# Altium schematic sheet STM32F103ZET6.SCHDOC
size A2
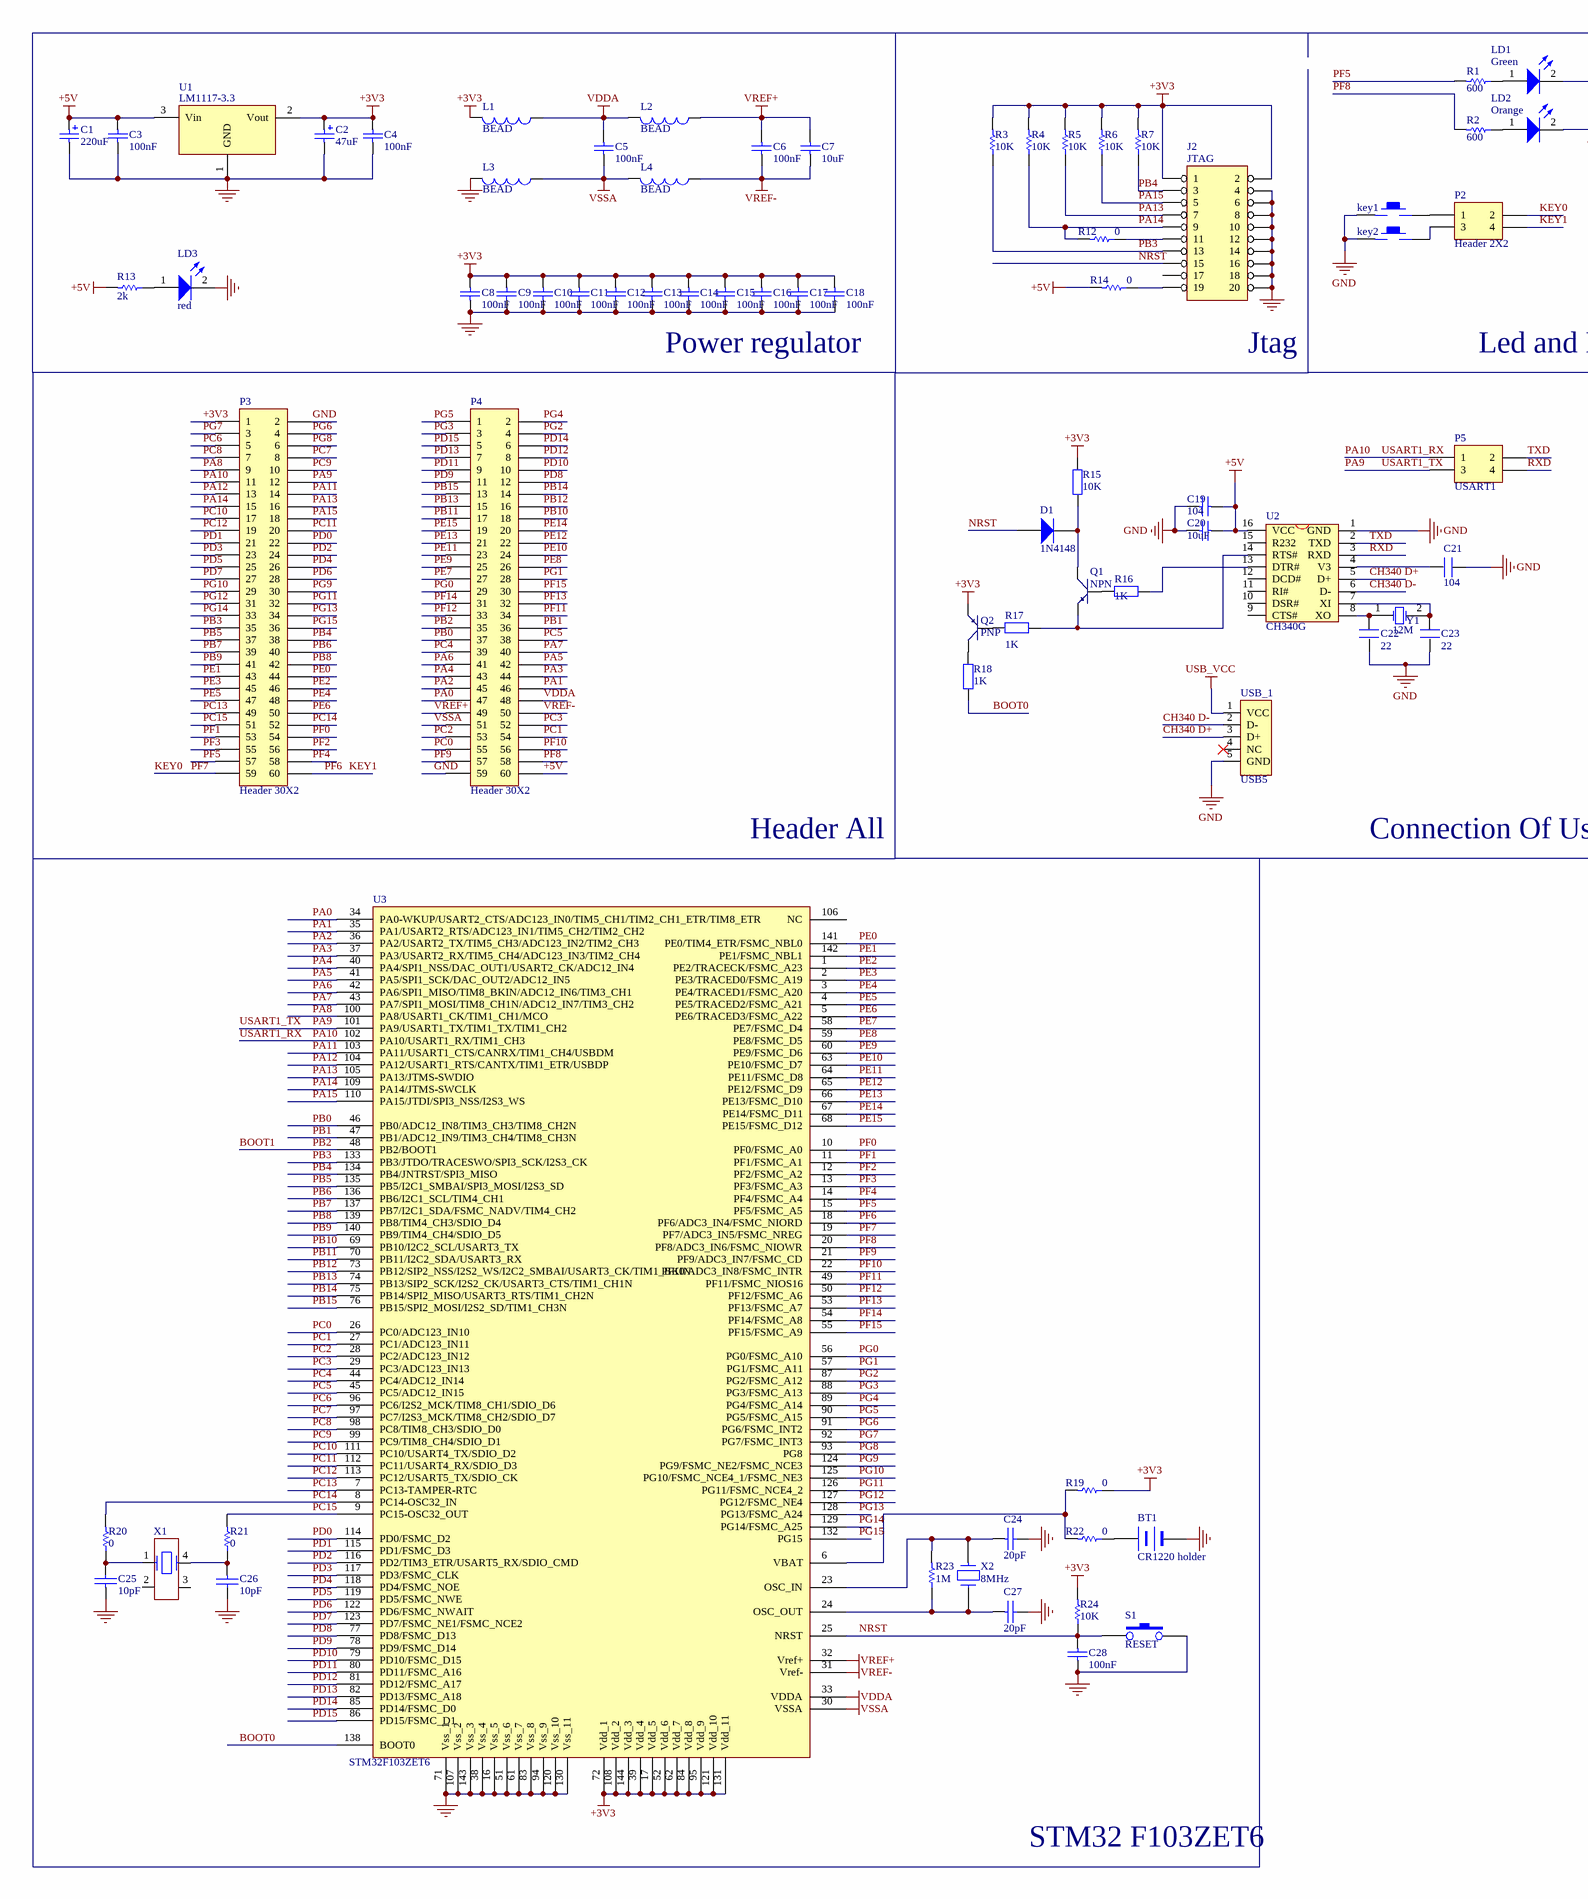
[diagram p0: STM32F103ZET6.SCHDOC, left]
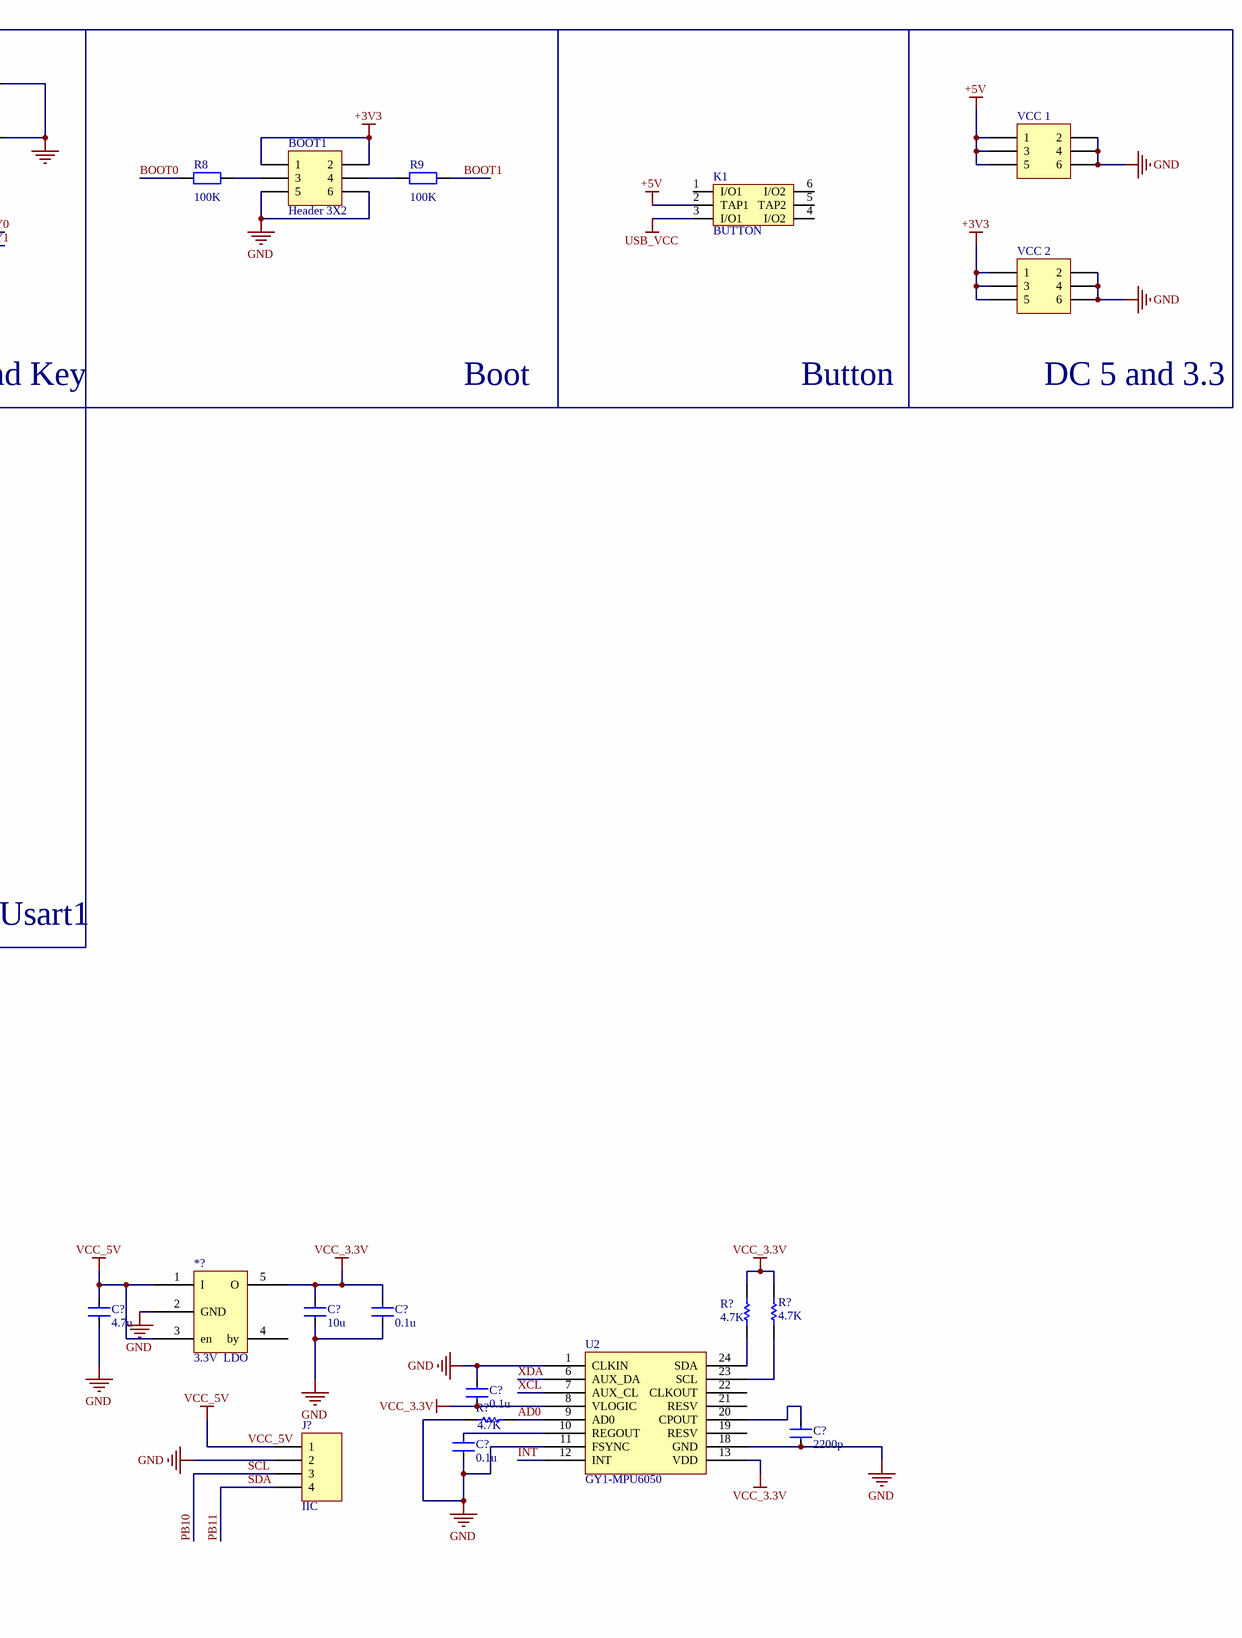
[diagram p1: STM32F103ZET6.SCHDOC, right]

## Parts
(Parts that share a designator on the sheet are numbered #1, #2 ... from top to bottom, then left to right.)
*?  3.3V  LDO  [SOT235]
BOOT1  Header 3X2  [HDR2X3]
BT1  CR1220 holder  [BAT]
C1  220uF  [3528]
C2  47uF  [3528]
C3  100nF  [0603P]
C4  100nF  [0603P]
C5  100nF  [0603P]
C6  100nF  [0603P]
C7  10uF  [3528]
C8  100nF  [0603P]
C9  100nF  [0603P]
C10  100nF  [0603P]
C11  100nF  [0603P]
C12  100nF  [0603P]
C13  100nF  [0603P]
C14  100nF  [0603P]
C15  100nF  [0603P]
C16  100nF  [0603P]
C17  100nF  [0603P]
C18  100nF  [0603P]
C19  value 104  [0603P]  (hidden comment: Cap)
C20  value 10uF  [0603P]  (hidden comment: Cap)
C21  104  [0603P]
C22  22  [0603P]
C23  22  [0603P]
C24  20pF  [0603P]
C25  10pF  [0603P]
C26  10pF  [0603P]
C27  20pF  [0603P]
C28  100nF  [0603P]
C?#1  4.7u  [1608[0603]]
C?#2  10u  [3.2X1.6X1.1]
C?#3  0.1u  [1608[0603]]
C?#4  0.1u  [1608[0603]]
C?#5  2200p  [1608[0603]]
C?#6  0.1u  [1608[0603]]
D1  1N4148  [DO-35]
J2  JTAG  [JTAG_20PIN]
J?  IIC  [SH-3]
K1  BUTTON  [BTN8.5*8.5]
key1  KEY_M  [KEY_M]  (value not drawn)
key2  KEY_M  [KEY_M]  (value not drawn)
L1  BEAD  [0603P]
L2  BEAD  [0603P]
L3  BEAD  [0603P]
L4  BEAD  [0603P]
LD1  Green  [0603P]
LD2  Orange  [0603P]
LD3  red  [0603P]
P2  Header 2X2  [HDR2X2]
P3  Header 30X2  [60pin]
P4  Header 30X2  [60pin]
P5  USART1  [HDR2X2]
Q1  NPN  [SOT-23R]
Q2  PNP  [SOT-23R]
R1  600  [0603P]
R2  600  [0603P]
R3  10K  [0603P]
R4  10K  [0603P]
R5  10K  [0603P]
R6  10K  [0603P]
R7  10K  [0603P]
R8  value 100K  [0603P]  (hidden comment: Res2)
R9  value 100K  [0603P]  (hidden comment: Res2)
R12  0  [0603P]
R13  2k  [0603P]
R14  0  [0603P]
R15  value 10K  [0603P]  (hidden comment: Res2)
R16  value 1K  [0603P]  (hidden comment: Res2)
R17  value 1K  [0603P]  (hidden comment: Res2)
R18  value 1K  [0603P]  (hidden comment: Res2)
R19  0  [0603P]
R20  0  [0603P]
R21  0  [0603P]
R22  0  [0603P]
R23  1M  [0603P]
R24  10K  [0603P]
R?#1  4.7K  [1608[0603]]
R?#2  4.7K  [1608[0603]]
R?#3  4.7K  [1608[0603]]
S1  RESET  [KEY_M]
U1  LM1117-3.3  [1117]
U2#1  CH340G  [SOP16M]
U2#2  GY1-MPU6050  [MPU6050]
U3  STM32F103ZET6  [TQFP144-B]
USB_1  USB5  [USB/SM0.8-6H5]
VCC_1  Header 3X2  [HDR2X3]  (value not drawn)
VCC_2  Header 3X2  [HDR2X3]  (value not drawn)
X1  MC306-G-06Q-32.768 (manufacturer JFVNY)  [SM8]  (value not drawn)
X2  8MHz  [XTAL_16S]
Y1  12M  [XTAL_US]

## Nets
+3V3: BOOT1.1 BOOT1.2 C2.1 C4.1 C8.1 C9.1 C10.1 C11.1 C12.1 C13.1 C14.1 C15.1 C16.1 C17.1 C18.1 J2.1 J2.2 L1.2 P3.1 Q2.1(E) R3.2 R4.2 R5.2 R6.2 R7.2 R15.2 R19.1 R24.2 U1.2(Vout) U3.17(Vdd_5) U3.39(Vdd_4) U3.52(Vdd_6) U3.62(Vdd_7) U3.72(Vdd_1) U3.84(Vdd_8) U3.95(Vdd_9) U3.108(Vdd_2) U3.121(Vdd_10) U3.131(Vdd_11) U3.144(Vdd_3) VCC_2.1 VCC_2.3 VCC_2.5
+5V: C1.1 C3.1 C19.2 C20.2 K1.2(TAP1) P4.60 R13.2 R14.2 U1.3(Vin) U2#1.16(VCC) VCC_1.1 VCC_1.3 VCC_1.5
GND: *?.2(GND) BOOT1.5 BOOT1.6 BT1.2(-) C1.2 C2.2 C3.2 C4.2 C8.2 C9.2 C10.2 C11.2 C12.2 C13.2 C14.2 C15.2 C16.2 C17.2 C18.2 C19.1 C20.1 C21.1 C22.1 C23.1 C24.2 C25.1 C26.2 C27.2 C28.1 C?#1.2 C?#2.2 C?#3.2 C?#4.1 C?#5.2 C?#6.2 J2.4 J2.6 J2.8 J2.10 J2.12 J2.14 J2.16 J2.18 J2.20 J?.2 key1.1 key2.1 L3.2 LD1.2(K) LD2.2(K) LD3.2(K) P3.2 P4.59 R?#3.1 S1.2 U1.1(GND) U2#1.1(GND) U2#2.1(CLKIN) U2#2.11(FSYNC) U2#2.18(GND) U3.16(Vss_5) U3.38(Vss_4) U3.51(Vss_6) U3.61(Vss_7) U3.71(Vss_1) U3.83(Vss_8) U3.94(Vss_9) U3.107(Vss_2) U3.120(Vss_10) U3.130(Vss_11) U3.143(Vss_3) USB_1.5(GND) VCC_1.2 VCC_1.4 VCC_1.6 VCC_2.2 VCC_2.4 VCC_2.6
USB_VCC: K1.3(I/O1) USB_1.1(VCC)
VCC_3.3V: *?.5(O) C?#2.1 C?#3.1 C?#4.2 R?#1.2 R?#2.2 U2#2.8(VLOGIC) U2#2.13(VDD)
VCC_5V: *?.1(I) *?.3(en) C?#1.1 J?.1
VDDA: C5.1 L1.1 L2.2 P4.48 U3.33(VDDA)
VREF+: C6.1 C7.1 L2.1 P4.49 U3.32(Vref+)
VREF-: C6.2 C7.2 L4.1 P4.50 U3.31(Vref-)
VSSA: C5.2 L3.1 L4.2 P4.51 U3.30(VSSA)
AD0: R?#3.2 U2#2.9(AD0)
BOOT0: R8.1 R18.1 U3.138(BOOT0)
BOOT1: P4.35 R9.2 U3.48(PB2/BOOT1)  [also labelled PB2]
CH340 D+: U2#1.5(D+) USB_1.3(D+)
CH340 D-: U2#1.6(D-) USB_1.2(D-)
INT: U2#2.12(INT)
KEY0: P2.2 P3.59 U3.19(PF7/ADC3_IN5/FSMC_NREG)  [also labelled PF7]
KEY1: P2.4 P3.60 U3.18(PF6/ADC3_IN4/FSMC_NIORD)  [also labelled PF6]
NRST: C28.2 D1.1(A) J2.15 R24.1 S1.1 U3.25(NRST)
PA0: P4.47 U3.34(PA0-WKUP/USART2_CTS/ADC123_IN0/TIM5_CH1/TIM2_CH1_ETR/TIM8_ETR)
PA1: P4.46 U3.35(PA1/USART2_RTS/ADC123_IN1/TIM5_CH2/TIM2_CH2)
PA2: P4.45 U3.36(PA2/USART2_TX/TIM5_CH3/ADC123_IN2/TIM2_CH3)
PA3: P4.44 U3.37(PA3/USART2_RX/TIM5_CH4/ADC123_IN3/TIM2_CH4)
PA4: P4.43 U3.40(PA4/SPI1_NSS/DAC_OUT1/USART2_CK/ADC12_IN4)
PA5: P4.42 U3.41(PA5/SPI1_SCK/DAC_OUT2/ADC12_IN5)
PA6: P4.41 U3.42(PA6/SPI1_MISO/TIM8_BKIN/ADC12_IN6/TIM3_CH1)
PA7: P4.40 U3.43(PA7/SPI1_MOSI/TIM8_CH1N/ADC12_IN7/TIM3_CH2)
PA8: P3.9 U3.100(PA8/USART1_CK/TIM1_CH1/MCO)
PA9: P3.12 P5.3 U3.101(PA9/USART1_TX/TIM1_TX/TIM1_CH2)  [also labelled USART1_TX]
PA10: P3.11 P5.1 U3.102(PA10/USART1_RX/TIM1_CH3)  [also labelled USART1_RX]
PA11: P3.14 U3.103(PA11/USART1_CTS/CANRX/TIM1_CH4/USBDM)
PA12: P3.13 U3.104(PA12/USART1_RTS/CANTX/TIM1_ETR/USBDP)
PA13: J2.7 P3.16 R5.1 U3.105(PA13/JTMS-SWDIO)
PA14: J2.9 P3.15 R4.1 R12.2 U3.109(PA14/JTMS-SWCLK)
PA15: J2.5 P3.18 R6.1 U3.110(PA15/JTDI/SPI3_NSS/I2S3_WS)
PB0: P4.37 U3.46(PB0/ADC12_IN8/TIM3_CH3/TIM8_CH2N)
PB1: P4.36 U3.47(PB1/ADC12_IN9/TIM3_CH4/TIM8_CH3N)
PB3: J2.13 P3.35 R3.1 U3.133(PB3/JTDO/TRACESWO/SPI3_SCK/I2S3_CK)
PB4: J2.3 P3.38 R7.1 U3.134(PB4/JNTRST/SPI3_MISO)
PB5: P3.37 U3.135(PB5/I2C1_SMBAI/SPI3_MOSI/I2S3_SD)
PB6: P3.40 U3.136(PB6/I2C1_SCL/TIM4_CH1)
PB7: P3.39 U3.137(PB7/I2C1_SDA/FSMC_NADV/TIM4_CH2)
PB8: P3.42 U3.139(PB8/TIM4_CH3/SDIO_D4)
PB9: P3.41 U3.140(PB9/TIM4_CH4/SDIO_D5)
PB10: J?.3 P4.18 U3.69(PB10/I2C2_SCL/USART3_TX)  [also labelled SCL]
PB11: J?.4 P4.17 U3.70(PB11/I2C2_SDA/USART3_RX)  [also labelled SDA]
PB12: P4.16 U3.73(PB12/SIP2_NSS/I2S2_WS/I2C2_SMBAI/USART3_CK/TIM1_BKIN)
PB13: P4.15 U3.74(PB13/SIP2_SCK/I2S2_CK/USART3_CTS/TIM1_CH1N)
PB14: P4.14 U3.75(PB14/SPI2_MISO/USART3_RTS/TIM1_CH2N)
PB15: P4.13 U3.76(PB15/SPI2_MOSI/I2S2_SD/TIM1_CH3N)
PC0: P4.55 U3.26(PC0/ADC123_IN10)
PC1: P4.54 U3.27(PC1/ADC123_IN11)
PC2: P4.53 U3.28(PC2/ADC123_IN12)
PC3: P4.52 U3.29(PC3/ADC123_IN13)
PC4: P4.39 U3.44(PC4/ADC12_IN14)
PC5: P4.38 U3.45(PC5/ADC12_IN15)
PC6: P3.5 U3.96(PC6/I2S2_MCK/TIM8_CH1/SDIO_D6)
PC7: P3.8 U3.97(PC7/I2S3_MCK/TIM8_CH2/SDIO_D7)
PC8: P3.7 U3.98(PC8/TIM8_CH3/SDIO_D0)
PC9: P3.10 U3.99(PC9/TIM8_CH4/SDIO_D1)
PC10: P3.17 U3.111(PC10/USART4_TX/SDIO_D2)
PC11: P3.20 U3.112(PC11/USART4_RX/SDIO_D3)
PC12: P3.19 U3.113(PC12/USART5_TX/SDIO_CK)
PC13: P3.49 U3.7(PC13-TAMPER-RTC)
PC14: P3.52 R20.2 U3.8(PC14-OSC32_IN)
PC15: P3.51 R21.2 U3.9(PC15-OSC32_OUT)
PD0: P3.22 U3.114(PD0/FSMC_D2)
PD1: P3.21 U3.115(PD1/FSMC_D3)
PD2: P3.24 U3.116(PD2/TIM3_ETR/USART5_RX/SDIO_CMD)
PD3: P3.23 U3.117(PD3/FSMC_CLK)
PD4: P3.26 U3.118(PD4/FSMC_NOE)
PD5: P3.25 U3.119(PD5/FSMC_NWE)
PD6: P3.28 U3.122(PD6/FSMC_NWAIT)
PD7: P3.27 U3.123(PD7/FSMC_NE1/FSMC_NCE2)
PD8: P4.12 U3.77(PD8/FSMC_D13)
PD9: P4.11 U3.78(PD9/FSMC_D14)
PD10: P4.10 U3.79(PD10/FSMC_D15)
PD11: P4.9 U3.80(PD11/FSMC_A16)
PD12: P4.8 U3.81(PD12/FSMC_A17)
PD13: P4.7 U3.82(PD13/FSMC_A18)
PD14: P4.6 U3.85(PD14/FSMC_D0)
PD15: P4.5 U3.86(PD15/FSMC_D1)
PE0: P3.44 U3.141(PE0/TIM4_ETR/FSMC_NBL0)
PE1: P3.43 U3.142(PE1/FSMC_NBL1)
PE2: P3.46 U3.1(PE2/TRACECK/FSMC_A23)
PE3: P3.45 U3.2(PE3/TRACED0/FSMC_A19)
PE4: P3.48 U3.3(PE4/TRACED1/FSMC_A20)
PE5: P3.47 U3.4(PE5/TRACED2/FSMC_A21)
PE6: P3.50 U3.5(PE6/TRACED3/FSMC_A22)
PE7: P4.27 U3.58(PE7/FSMC_D4)
PE8: P4.26 U3.59(PE8/FSMC_D5)
PE9: P4.25 U3.60(PE9/FSMC_D6)
PE10: P4.24 U3.63(PE10/FSMC_D7)
PE11: P4.23 U3.64(PE11/FSMC_D8)
PE12: P4.22 U3.65(PE12/FSMC_D9)
PE13: P4.21 U3.66(PE13/FSMC_D10)
PE14: P4.20 U3.67(PE14/FSMC_D11)
PE15: P4.19 U3.68(PE15/FSMC_D12)
PF0: P3.54 U3.10(PF0/FSMC_A0)
PF1: P3.53 U3.11(PF1/FSMC_A1)
PF2: P3.56 U3.12(PF2/FSMC_A2)
PF3: P3.55 U3.13(PF3/FSMC_A3)
PF4: P3.58 U3.14(PF4/FSMC_A4)
PF5: P3.57 R1.2 U3.15(PF5/FSMC_A5)
PF8: P4.58 R2.2 U3.20(PF8/ADC3_IN6/FSMC_NIOWR)
PF9: P4.57 U3.21(PF9/ADC3_IN7/FSMC_CD)
PF10: P4.56 U3.22(PF10/ADC3_IN8/FSMC_INTR)
PF11: P4.34 U3.49(PF11/FSMC_NIOS16)
PF12: P4.33 U3.50(PF12/FSMC_A6)
PF13: P4.32 U3.53(PF13/FSMC_A7)
PF14: P4.31 U3.54(PF14/FSMC_A8)
PF15: P4.30 U3.55(PF15/FSMC_A9)
PG0: P4.29 U3.56(PG0/FSMC_A10)
PG1: P4.28 U3.57(PG1/FSMC_A11)
PG2: P4.4 U3.87(PG2/FSMC_A12)
PG3: P4.3 U3.88(PG3/FSMC_A13)
PG4: P4.2 U3.89(PG4/FSMC_A14)
PG5: P4.1 U3.90(PG5/FSMC_A15)
PG6: P3.4 U3.91(PG6/FSMC_INT2)
PG7: P3.3 U3.92(PG7/FSMC_INT3)
PG8: P3.6 U3.93(PG8)
PG9: P3.30 U3.124(PG9/FSMC_NE2/FSMC_NCE3)
PG10: P3.29 U3.125(PG10/FSMC_NCE4_1/FSMC_NE3)
PG11: P3.32 U3.126(PG11/FSMC_NCE4_2)
PG12: P3.31 U3.127(PG12/FSMC_NE4)
PG13: P3.34 U3.128(PG13/FSMC_A24)
PG14: P3.33 U3.129(PG14/FSMC_A25)
PG15: P3.36 U3.132(PG15)
RXD: P5.4 U2#1.3(RXD)
TXD: P5.2 U2#1.2(TXD)
XCL: U2#2.7(AUX_CL)
XDA: U2#2.6(AUX_DA)
NetBOOT1_3: BOOT1.3 R8.2
NetBOOT1_4: BOOT1.4 R9.1
NetBT1_1: BT1.1(+) R22.1
NetC21_2: C21.2 U2#1.4(V3)
NetC22_2: C22.2 U2#1.8(XO) Y1.1(OSC1)
NetC23_2: C23.2 U2#1.7(XI) Y1.2(OSC2)
NetC24_1: C24.1 R23.2 U3.23(OSC_IN) X2.1
NetC25_2: C25.2 R20.1 X1.1
NetC26_1: C26.1 R21.1 X1.4
NetC27_1: C27.1 R23.1 U3.24(OSC_OUT) X2.2
NetC?#5_1: C?#5.1 U2#2.20(CPOUT)
NetC?#6_1: C?#6.1 U2#2.10(REGOUT)
NetD1_2: D1.2(K) Q1.3(C) R15.1
NetJ2_11: J2.11 R12.1
NetJ2_19: J2.19 R14.1
Netkey1_2: key1.2 P2.1
Netkey2_2: key2.2 P2.3
NetLD1_1: LD1.1(A) R1.1
NetLD2_1: LD2.1(A) R2.1
NetLD3_1: LD3.1(A) R13.1
NetQ1_1: Q1.1(E) R17.2 U2#1.14(RTS#)
NetQ1_2: Q1.2(B) R16.1
NetQ2_2: Q2.2(B) R17.1
NetQ2_3: Q2.3(C) R18.2
NetR16_2: R16.2 U2#1.13(DTR#)
NetR19_2: R19.2 R22.2 U3.6(VBAT)
NetR?#1_1: R?#1.1 U2#2.24(SDA)
NetR?#2_1: R?#2.1 U2#2.23(SCL)

Not connected (* = marked no-connect by the designer): *? 4(by); J2 17; K1 1(I/O1) 4(I/O2) 5(TAP2) 6(I/O2); U2#1 9(CTS#) 10(DSR#) 11(RI#) 12(DCD#) 15(R232); U2#2 19(RESV) 21(RESV) 22(CLKOUT); U3 106(NC); USB_1 4(NC)*; X1 2 3

## Notes on the sheet
- Power regulator
- (near J2) Jtag
- Led and Key
- Boot
- Button
- DC 5 and 3.3
- Header All
- Connection Of Usart1
- STM32 F103ZET6

## Library data of the parts
BOOT1 VCC_1 VCC_2 = Header 3X2: Header, 3-Pin, Dual row; LatestRevisionDate: *; LatestRevisionNote: *; Publisher: *
BT1 = BATTERY
C1 C2 = Cap Pol1: Polarized Capacitor (Radial); Value: 10uF; Published: 8-Jun-2000; Revision: July-2002: Re-released for DXP Platform.; Publisher: Altium Limited
C3-C7 = Cap: Capacitor; Value: 10nF; Published: 8-Jun-2000; Revision: July-2002: Re-released for DXP Platform.; Publisher: Altium Limited
C8-C18 C24-C27 = CAP: Capacitor
  C8-C18: Published: 8-Jun-2000; Revision: July-2002: Re-released for DXP Platform.; Publisher: Altium Limited; Value: 100nF
C19 C20 = Cap: Capacitor; Published: 8-Jun-2000; LatestRevisionDate: 17-Jul-2002; LatestRevisionNote: Re-released for DXP Platform.; PackageReference: RAD-0.3; Publisher: Altium Limited
C21-C23 = C
C28 = CAP: Capacitor; Value: 100pF; Published: 8-Jun-2000; Revision: July-2002: Re-released for DXP Platform.; Publisher: Altium Limited
C?#1-C?#6 = CAP-0.1UF: SMD-CAP
D1 = Diode 1N4148: High Conductance Fast Diode; Published: 8-Jun-2000; LatestRevisionDate: 17-Jul-2002; LatestRevisionNote: Re-released for DXP Platform.; DatasheetDocument: 1997; PackageReference: DO-35; Publisher: Altium Limited; Code_JEDEC: DO-204-AH; ComponentLink1Description: Manufacturer Link; ComponentLink1URL: http://www.fairchildsemi.com/; ComponentLink2Description: Datasheet; ComponentLink2URL: http://www.fairchildsemi.com/ds/1N%2F1N4148.pdf
J2 = HEADER 10X2
J? = Header 4: Header, 4-Pin; LatestRevisionDate: 17-Jul-2002; LatestRevisionNote: Re-released for DXP Platform.; Publisher: Altium Limited
L1-L4 = Inductor: Value: 100uH; Published: 8-Jun-2000; Revision: July-2002: Re-released for DXP Platform.; Publisher: Altium Limited
LD1-LD3 = LED2: Typical RED, GREEN, YELLOW, AMBER GaAs LED; Published: 8-Jun-2000; Revision: July-2002: Re-released for DXP Platform.; Publisher: Altium Limited
P2 P5 = Header 2X2: Header, 2-Pin, Dual row; LatestRevisionDate: *; LatestRevisionNote: *; Publisher: *
P3 P4 = Header 30X2: Header, 30-Pin, Dual row; LatestRevisionDate: 17-Jul-2002; LatestRevisionNote: Re-released for DXP Platform.; Publisher: Altium Limited
Q1 = NPN: 8050/BCW846/BCW847
Q2 = PNP: 8550/BCW68
R1-R7 R12 R14 R19-R23 = Res1: Resistor; Value: 1K; Published: 8-Jun-2000; Revision: July-2002: Re-released for DXP Platform.; Publisher: Altium Limited
R8 R9 R15-R18 = Res2: Resistor; Published: 8-Jun-2000; LatestRevisionDate: 17-Jul-2002; LatestRevisionNote: Re-released for DXP Platform.; PackageReference: AXIAL-0.4; Publisher: Altium Limited
R13 R24 = res1: Resistor; Value: 1K; Published: 8-Jun-2000; Revision: July-2002: Re-released for DXP Platform.; Publisher: Altium Limited
R?#1-R?#3 = Res1: Resistor; Published: 8-Jun-2000; LatestRevisionDate: 17-Jul-2002; LatestRevisionNote: Re-released for DXP Platform.; PackageReference: AXIAL-0.3; Publisher: Altium Limited; PackageDescription: Axial Device, Thru-Hole; 2 Leads; 0.3 in Pin Spacing; Value: 4.7K
S1 = SW-PB
U1 = VOLTREG1
U2#1 = CH340G: USB2UART
U2#2 = Component_1
X1 = MC306
X2 = CRYSTAL
Y1 = XTAL: Crystal Oscillator; Published: *; LatestRevisionDate: *; LatestRevisionNote: *; Publisher: *